# EAGLE design ESPcam (EAGLE 7.7.0)
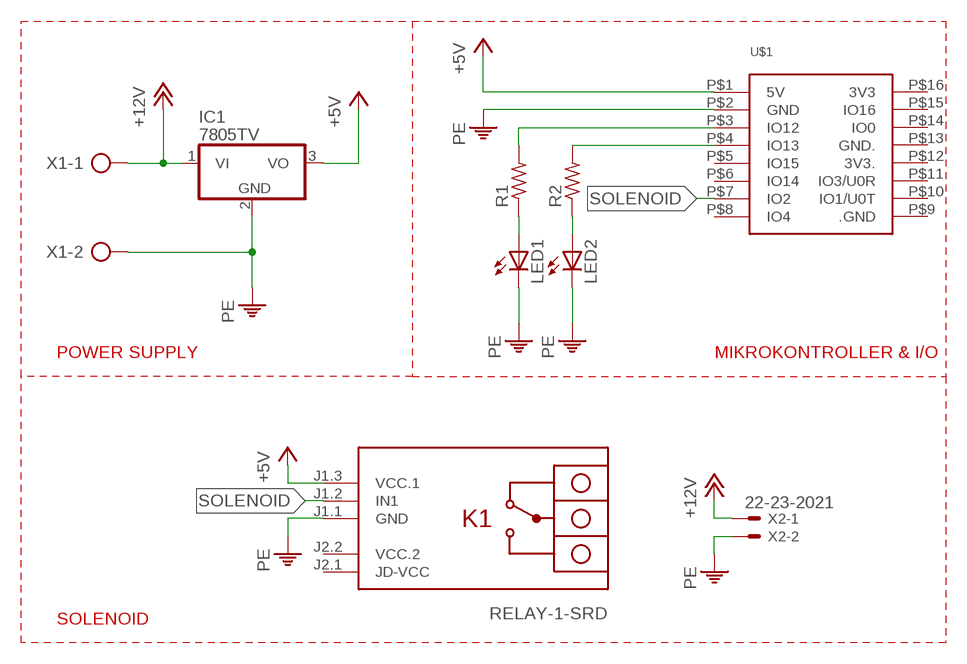
[diagram p0: schematic, sheet 1]

## Parts
IC1  7805TV  [TO220V]
LED1  LED5MM  [LED5MM]
LED2  LED5MM  [LED5MM]
R1  R-US_0207/15  [0207/15]
R2  R-US_0207/15  [0207/15]
U$1  ESP32-CAM  [ESP32-CAM]
U$2  RELAY-1-SRD  [RELAY-1-SRD]
X1  AK500/2-H  [AK500/2-H]
X2  22-23-2021  [22-23-2021]

## Nets
+5V: IC1.3(VO) U$1.P$1(5V) U$2.J1.3(VCC.1)
+12V: IC1.1(VI) X1.1 X2.1
N$1: LED1.A R1.1
N$2: LED2.A R2.1
N$3: R1.2 U$1.P$3(IO12)
N$5: R2.2 U$1.P$4(IO13)
PE: IC1.2(GND) LED1.K(C) LED2.K(C) U$1.P$2(GND) U$2.J1.1(GND) X1.2 X2.2
SOLENOID: U$1.P$7(IO2) U$2.J1.2(IN1)
Unconnected: U$1.P$5(IO15) U$1.P$6(IO14) U$1.P$8(IO4) U$1.P$9(.GND) U$1.P$10(IO1/U0T) U$1.P$11(IO3/U0R) U$1.P$12(3V3.) U$1.P$13(GND.) U$1.P$14(IO0) U$1.P$15(IO16) U$1.P$16(3V3) U$2.J2.1(JD-VCC)

## Notes on the sheet
- POWER SUPPLY | MIKROKONTROLLER & I/O
- SOLENOID

## Power pins joined to a net without a drawn wire
VCC.2: U$2.J2.2(VCC.2)

## Library data of the parts
IC1 = linear:78*: Positive VOLTAGE REGULATOR Source: http://cache.national.com/ds/LM/LM78L05.pdf http://www.fairchildsemi.com/ds/LM/LM7805.pdf
LED1 LED2 = led:LED: LED OSRAM: - CHIPLED LG R971, LG N971, LY N971, LG Q971, LY Q971, LO R971, LY R971 LH N974, LH R974 LS Q976, LO Q976, LY Q976 LO Q996 - Hyper CHIPLED LW Q18S LB Q993, LB Q99A, LB R99A - SideLED LS A670, LO A670, LY A670, LG A670, LP A670 LB A673, LV A673, LT A673, LW A673 LH A674 LY A675 LS A676, LA A676, LO A676, LY A676, LW A676 LS A679, LY A679, LG A679 - Hyper Micro SIDELED® LS Y876, LA Y876, LO Y876, LY Y876 LT Y87S - SmartLED LW L88C, LW L88S LB L89C, LB L89S, LG L890 LS L89K, LO L89K, LY L89K LS L896, LA L896, LO L896, LY L896 - TOPLED LS T670, LO T670, LY T670, LG T670, LP T670 LSG T670, LSP T670, LSY T670, LOP T670, LYG T670 LG T671, LOG T671, LSG T671 LB T673, LV T673, LT T673, LW T673 LH T674 LS T676, LA T676, LO T676, LY T676, LB T676, LH T676, LSB T676, LW T676 LB T67C, LV T67C, LT T67C, LS T67K, LO T67K, LY T67K, LW E67C LS E67B, LA E67B, LO E67B, LY E67B, LB E67C, LV E67C, LT E67C LW T67C LS T679, LY T679, LG T679 LS T770, LO T770, LY T770, LG T770, LP T770 LB T773, LV T773, LT T773, LW T773 LH T774 LS E675, LA E675, LY E675, LS T675 LS T776, LA T776, LO T776, LY T776, LB T776 LHGB T686 LT T68C, LB T68C - Hyper Mini TOPLED® LB M676 - Mini TOPLED Santana® LG M470 LS M47K, LO M47K, LY M47K Source: http://www.osram.convergy.de LUXEON: - LUMILED® LXK2-PW12-R00, LXK2-PW12-S00, LXK2-PW14-U00, LXK2-PW14-V00 LXK2-PM12-R00, LXK2-PM12-S00, LXK2-PM14-U00 LXK2-PE12-Q00, LXK2-PE12-R00, LXK2-PE12-S00, LXK2-PE14-T00, LXK2-PE14-U00 LXK2-PB12-K00, LXK2-PB12-L00, LXK2-PB12-M00, LXK2-PB14-N00, LXK2-PB14-P00, LXK2-PB14-Q00 LXK2-PR12-L00, LXK2-PR12-M00, LXK2-PR14-Q00, LXK2-PR14-R00 LXK2-PD12-Q00, LXK2-PD12-R00, LXK2-PD12-S00 LXK2-PH12-R00, LXK2-PH12-S00 LXK2-PL12-P00, LXK2-PL12-Q00, LXK2-PL12-R00 Source: www.luxeon.com KINGBRIGHT: KA-3528ASYC Source: www.kingbright.com
R1 R2 = rcl:R-US_: RESISTOR, American symbol
U$1 = ESP32-CAM:ESP32-CAM: Check prices <https://pricing.snapeda.com/parts/ESP32-CAM/AI-Thinker/view-part?ref=eda>; AVAILABILITY: Not in stock; DESCRIPTION: ESP32 ESP32 Transceiver; 802.11 a/b/g/n (Wi-Fi, WiFi, WLAN), Bluetooth® Smart 4.x Low Energy (BLE) Evaluation Board; MF: AI-Thinker; MP: ESP32-CAM; PACKAGE: None; PRICE: None
U$2 = diy-modules:RELAY-1-SRD: 1-Channel Relay Module based on SRD-05VDC-SL-C relays Click here to find device on ebay.com <http://www.ebay.com/sch/one+channel+isolated+relay+5v>
X1 = con-ptr500:AK500/2-H: CONNECTOR Aug. 2004 / PTR Meßtechnik: Die Bezeichnung der Serie AK505 wurde geändert. Es handelt sich hierbei um AK500 in horizontaler Ausführung.; OC_FARNELL: unknown; OC_NEWARK: unknown
X2 = con-molex:22-23-2021: .100" (2.54mm) Center Header - 2 Pin; MF: MOLEX; MPN: 22-23-2021; OC_FARNELL: 1462926; OC_NEWARK: 25C3832

## Board
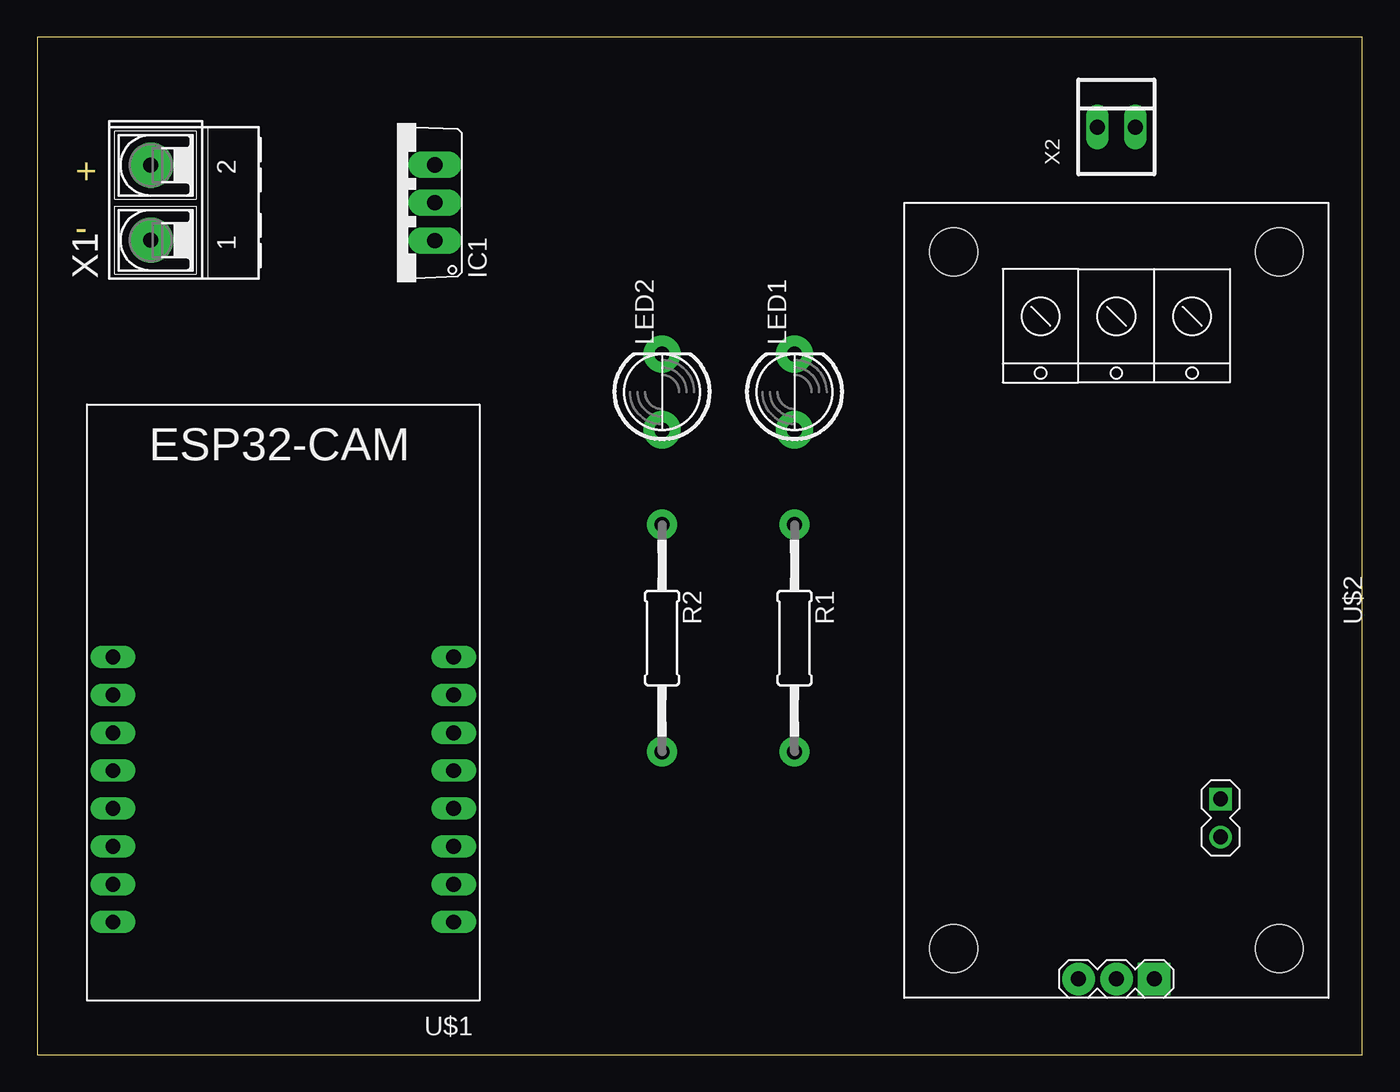
[diagram p1: board, top side]
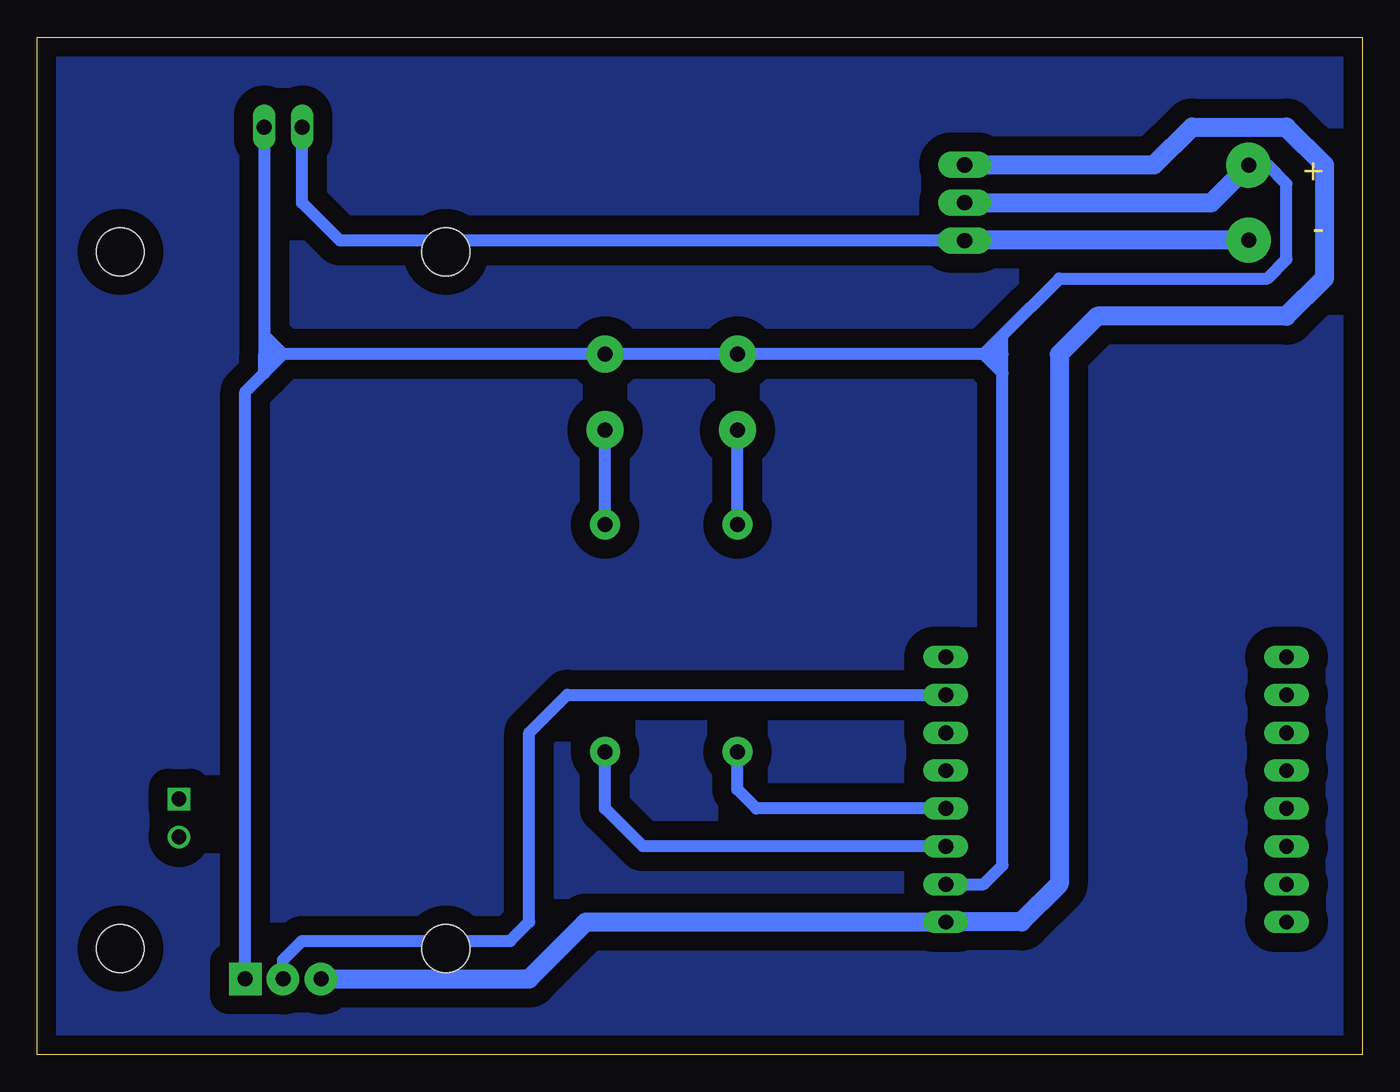
[diagram p2: board, bottom side, seen from below]

Size 88.88 x 68.25 mm. Coordinates in mm from the lower left corner, seen from the top.
Outline: 0,0 88.88,0 88.88,68.25 0,68.25 0,0
Copper layers (1*16): Top 0.035mm / dielectric 1.5mm / Bottom 0.035mm
Design rules "default": minimum track width 10mil, minimum drill 24mil, track to track 8mil, track to pad 8mil, pad to pad 8mil, via to via 8mil, smd to smd 8mil, copper to edge 40mil, drill to drill 8mil, minimum pad ring 10mil, minimum via ring 8mil, stop-mask expansion 4mil, vias tented up to drill 0mil, thermal gap 10mil

### Footprints (pad centres in the part's own frame; a part is rotated, then mirrored left to right if it is on the bottom)
TO220V = drill 1.016 pad 1.778 long: 1 -2.54,-2.54; 2 0,-2.54; 3 2.54,-2.54
LED5MM = drill 1 pad 2.5: A -2.54,0; K 2.54,0
0207/15 = drill 0.813 octagon: 1 -7.62,0; 2 7.62,0 | drill 1 pad 2: P$1 7.62,0; P$2 -7.62,0
ESP32-CAM = drill 1 pad 1.422 long: P$1 -11.43,10.16; P$2 -11.43,7.62; P$3 -11.43,5.08; P$4 -11.43,2.54; P$5 -11.43,0; P$6 -11.43,-2.54; P$7 -11.43,-5.08; P$8 -11.43,-7.62; P$9 11.43,-7.62; P$10 11.43,-5.08; P$11 11.43,-2.54; P$12 11.43,0; P$13 11.43,2.54; P$14 11.43,5.08; P$15 11.43,7.62; P$16 11.43,10.16
RELAY-1-SRD = drill 1 pad 2.184 square: J1.1 25.4,2.54 | drill 1 pad 2.184: J1.2 25.4,0; J1.3 25.4,-2.54 | drill 1 square: J2.1 13.335,6.985 | drill 1: J2.2 15.875,6.985 | hole 3.2: -23.368,10.922; 23.368,10.922; 23.368,-10.922; -23.368,-10.922
AK500/2-H = drill 1 pad 3: 1 -2.515,0; 2 2.515,0
22-23-2021 = drill 1 pad 1.422 long: 1 -1.27,0; 2 1.27,0

### Placement (x,y rotation side)
IC1  24.13,57.15 90 top
LED1  50.8,44.45 90 top
LED2  41.91,44.45 90 top
R1  50.8,27.94 270 top
R2  41.91,27.94 270 top
U$1  16.51,19.05 180 top
U$2  72.39,30.48 270 top
X1  7.62,57.15 90 top
X2  72.39,62.23 0 top

### Tracks (layer width: path | path; a pad name or v marks a point on that pad's centre or on a via)
+5V
  Bottom 1.27: IC1.3 13.97,59.69 11.43,62.23 5.08,62.23 2.54,59.69 2.54,52.07 5.08,49.53 17.78,49.53 20.32,46.99 20.32,11.43 22.86,8.89 U$1.P$1 52.07,8.89 55.88,5.08 U$2.J1.3
+12V
  Bottom 0.813: 26.64,54.63 IC1.1 27.94,54.61 68.58,54.61 71.12,57.15 X2.1
  Bottom 1.27: X1.1 27.91,54.63 27.94,54.61
N$1
  Bottom 0.813: R1.1 LED1.A
N$2
  Bottom 0.813: R2.1 LED2.A
N$3
  Bottom 0.813: U$1.P$3 48.26,13.97 50.8,16.51 R1.2
N$4
  pour Bottom (isolate 1.27): 0,68.58 88.9,68.58 88.9,0 0,0
N$5
  Bottom 0.813: U$1.P$4 40.64,16.51 41.91,17.78 R2.2
PE
  Bottom 0.813: U$1.P$2 25.4,11.43 24.13,12.7 24.13,45.72 | 24.13,45.72 24.13,46.99 | 24.13,46.99 24.13,48.26 | 24.13,48.26 20.32,52.07 6.35,52.07 5.08,53.34 5.08,58.42 6.35,59.69 7.59,59.69 X1.2 | X2.2 73.66,48.26 | 73.66,48.26 72.39,46.99 | 25.4,46.99 24.13,46.99 | U$2.J1.1 74.93,44.45 73.66,45.72 | 73.66,45.72 72.39,46.99 | 73.66,45.72 73.66,46.99 | 73.66,48.26 73.66,46.99 | 73.66,46.99 72.39,46.99 | 24.13,48.26 25.4,46.99 | 25.4,46.99 24.13,45.72 | 25.4,46.99 LED2.K LED1.K 72.39,46.99
  Bottom 1.27: IC1.2 10.13,57.15 X1.2
SOLENOID
  Bottom 0.813: U$2.J1.2 72.39,6.35 71.12,7.62 57.15,7.62 55.88,8.89 55.88,21.59 53.34,24.13 U$1.P$7

### Text on the board
Dimension: + | -